# EAGLE design OCTA-STM (EAGLE 8.1.0)

## Sheet 1 of 2
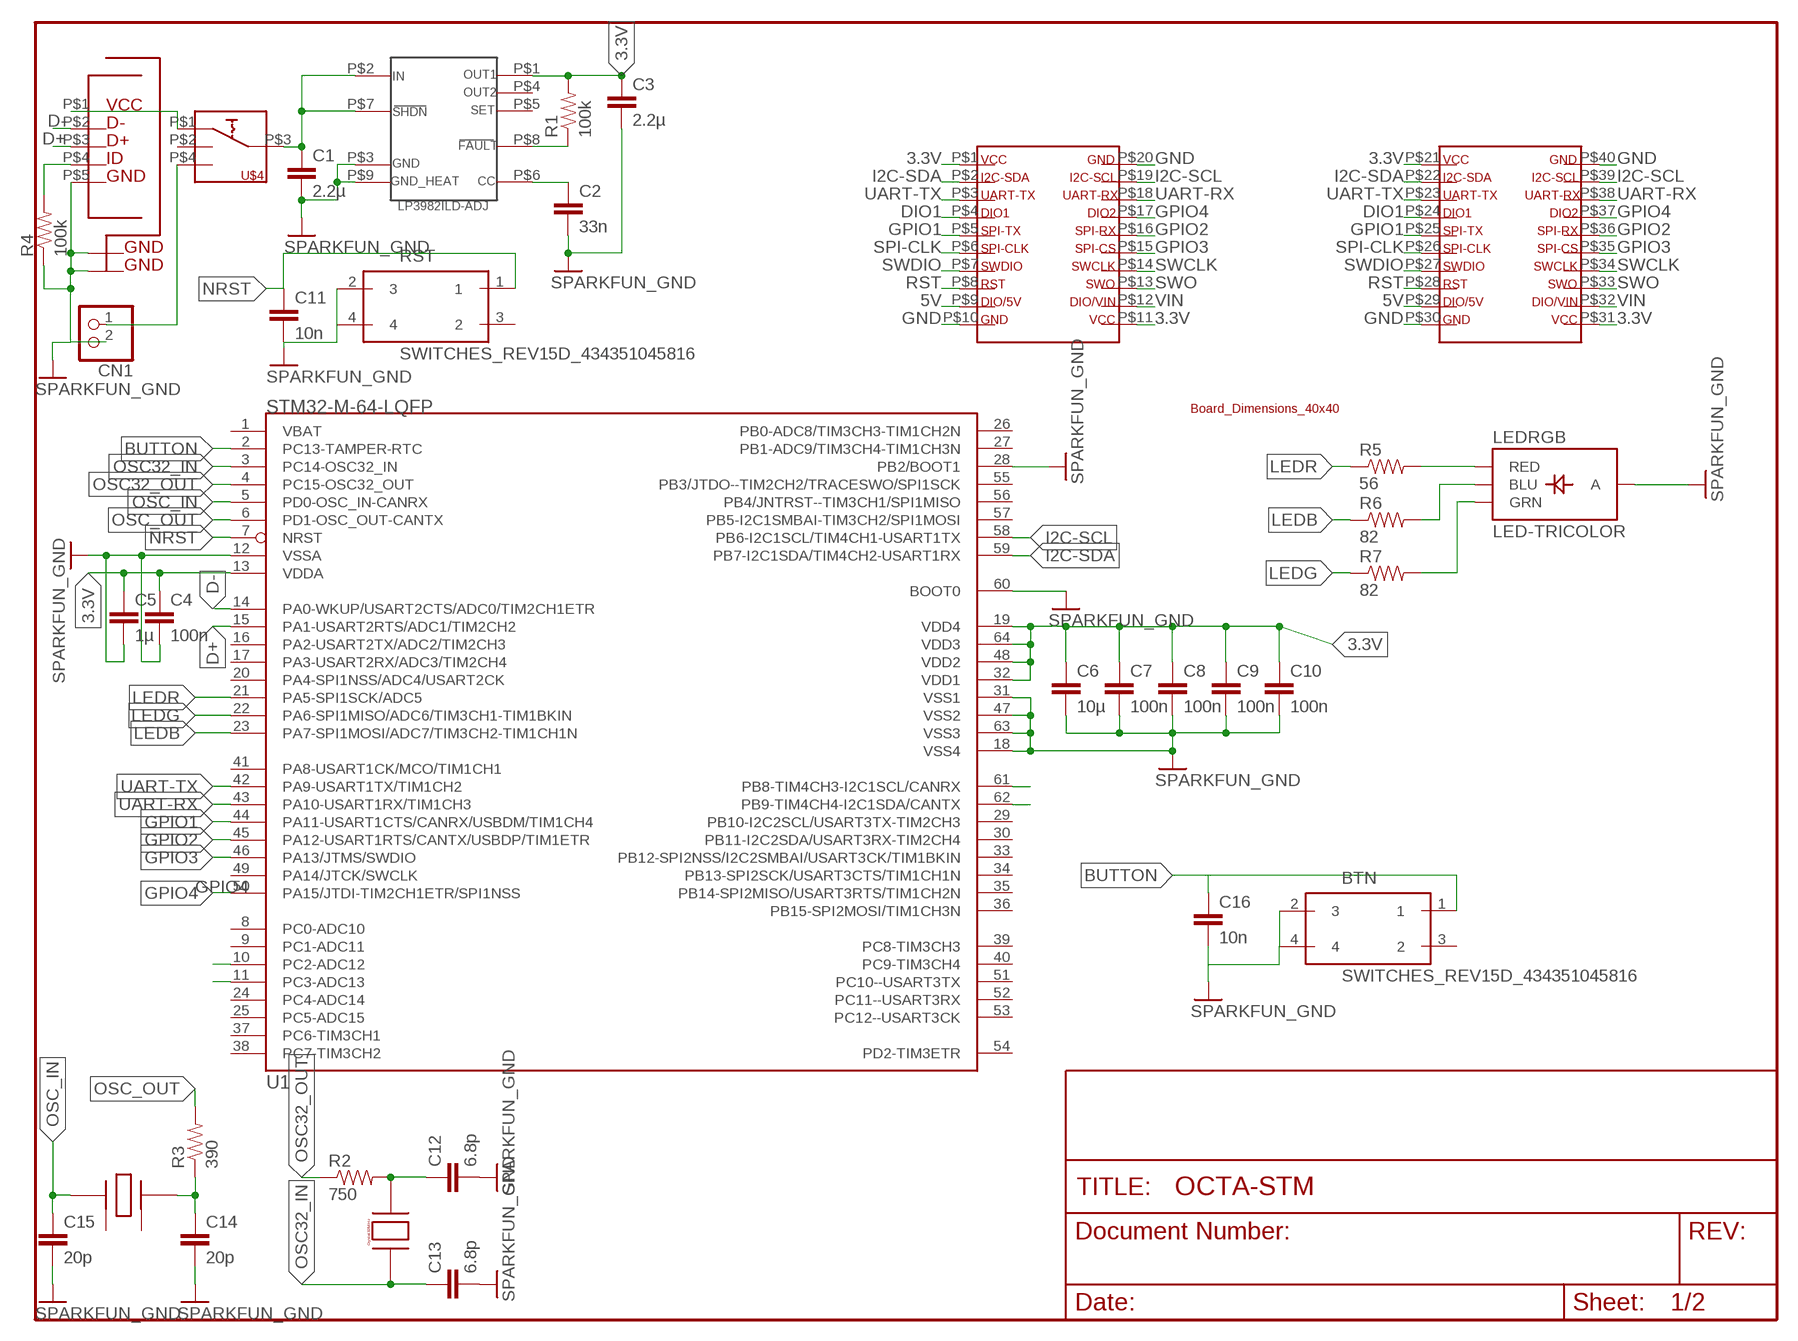
[diagram p0: schematic, sheet 1]

### Parts
BTN  SWITCHES_REV15D_434351045816  [SWITCHES_REV15D_434351045816]
C1  2.2µ  SPARKFUN_CAP0603-CAP  [SPARKFUN_0603-CAP]
C2  33n  SPARKFUN_CAP0603-CAP  [SPARKFUN_0603-CAP]
C3  2.2µ  SPARKFUN_CAP0603-CAP  [SPARKFUN_0603-CAP]
C4  100n  SPARKFUN_CAP0603-CAP  [SPARKFUN_0603-CAP]
C5  1µ  SPARKFUN_CAP0603-CAP  [SPARKFUN_0603-CAP]
C6  10µ  SPARKFUN_CAP0603-CAP  [SPARKFUN_0603-CAP]
C7  100n  SPARKFUN_CAP0603-CAP  [SPARKFUN_0603-CAP]
C8  100n  SPARKFUN_CAP0603-CAP  [SPARKFUN_0603-CAP]
C9  100n  SPARKFUN_CAP0603-CAP  [SPARKFUN_0603-CAP]
C10  100n  SPARKFUN_CAP0603-CAP  [SPARKFUN_0603-CAP]
C11  10n  SPARKFUN_CAP0603-CAP  [SPARKFUN_0603-CAP]
C12  6.8p  SPARKFUN_CAP0603-CAP  [SPARKFUN_0603-CAP]
C13  6.8p  SPARKFUN_CAP0603-CAP  [SPARKFUN_0603-CAP]
C14  20p  SPARKFUN_CAP0603-CAP  [SPARKFUN_0603-CAP]
C15  20p  SPARKFUN_CAP0603-CAP  [SPARKFUN_0603-CAP]
C16  10n  SPARKFUN_CAP0603-CAP  [SPARKFUN_0603-CAP]
CN1  ADAFRUIT_JST_2PIN-SMT-RA  [ADAFRUIT_JST-PH-2-SMT-RA]
LEDRGB  LED-TRICOLOR  [LED-TRICOLOR-SMD]
R1  100k  SPARKFUN_RESISTOR0603-RES  [SPARKFUN_0603-RES]
R2  750  SPARKFUN_RESISTOR0603-RES  [SPARKFUN_0603-RES]
R3  390  SPARKFUN_RESISTOR0603-RES  [SPARKFUN_0603-RES]
R4  100k  SPARKFUN_RESISTOR0603-RES  [SPARKFUN_0603-RES]
R5  56  SPARKFUN_RESISTOR0603-RES  [SPARKFUN_0603-RES]
R6  82  SPARKFUN_RESISTOR0603-RES  [SPARKFUN_0603-RES]
R7  82  SPARKFUN_RESISTOR0603-RES  [SPARKFUN_0603-RES]
RST  SWITCHES_REV15D_434351045816  [SWITCHES_REV15D_434351045816]
U1  STM32-M-64-LQFP  [LQFP64]
U$1  OCTA-CORE_MCIRO-USB2  [OCTA-CORE_MICRO-USB2]
U$2  BOARD-DIMENSIONS-40X40  [BOARD-DIMENSIONS-40X40]
U$3  DRAGAN-PERSONAL_TI-3.3V-REGULATOR  [DRAGAN-PERSONAL_TI-3.3V-REGULATOR]
U$4  OCTA-CORE_SP3T  [OCTA-CORE_SP3T]
U$5  DRAGAN-PERSONAL_CRYSTAL_32MHZ  [DRAGAN-PERSONAL_CRYSTAL_32MHZ]
U$7  DRAGAN-PERSONAL_XTAL-26MHZ  [DRAGAN-PERSONAL_XTAL-26MHZ]

### Nets
3.3V: C3.1 C4.1 C5.1 C6.1 C7.1 C8.1 C9.1 C10.1 R1.2 U1.13(VDDA) U1.19(VDD4) U1.32(VDD1) U1.48(VDD2) U1.64(VDD3) U$2.P$1 U$2.P$11 U$2.P$21 U$2.P$31 U$3.P$1
5V: U$2.P$9 U$2.P$29
10: U1.10(PC2-ADC12)
11: U1.11(PC3-ADC13)
61: U1.61(PB8-TIM4CH3-I2C1SCL/CANRX)
62: U1.62(PB9-TIM4CH4-I2C1SDA/CANTX)
BUTTON: BTN.1 C16.1 U1.2(PC13-TAMPER-RTC)
D+: U1.15(PA1-USART2RTS/ADC1/TIM2CH2) U$1.P$3
D-: U1.14(PA0-WKUP/USART2CTS/ADC0/TIM2CH1ETR) U$1.P$2
DIO1: U$2.P$4 U$2.P$24
GND: BTN.2 BTN.4 C1.2 C2.2 C3.2 C4.2 C5.2 C6.2 C7.2 C8.2 C9.2 C10.2 C11.2 C12.2 C13.2 C14.2 C15.2 C16.2 CN1.2 LEDRGB.A R4.1 RST.2 RST.4 U1.12(VSSA) U1.18(VSS4) U1.28(PB2/BOOT1) U1.31(VSS1) U1.47(VSS2) U1.60(BOOT0) U1.63(VSS3) U$1.P$5 U$1.P$6 U$1.P$7 U$1.P$8 U$1.P$9 U$1.P$10 U$1.P$11 U$1.P$12 U$1.P$13 U$2.P$10 U$2.P$20 U$2.P$30 U$2.P$40 U$3.P$3 U$3.P$9 ; supply symbol labelled SPARKFUN_GND ; also sheet 2
GPIO1: U1.44(PA11-USART1CTS/CANRX/USBDM/TIM1CH4) U$2.P$5 U$2.P$25
GPIO2: U1.45(PA12-USART1RTS/CANTX/USBDP/TIM1ETR) U$2.P$16 U$2.P$36
GPIO3: U1.46(PA13/JTMS/SWDIO) U$2.P$15 U$2.P$35
GPIO4: U1.50(PA15/JTDI-TIM2CH1ETR/SPI1NSS) U$2.P$17 U$2.P$37
I2C-SCL: U1.58(PB6-I2C1SCL/TIM4CH1-USART1TX) U$2.P$19 U$2.P$39
I2C-SDA: U1.59(PB7-I2C1SDA/TIM4CH2-USART1RX) U$2.P$2 U$2.P$22
LEDB: R6.1 U1.23(PA7-SPI1MOSI/ADC7/TIM3CH2-TIM1CH1N)
LEDG: R7.1 U1.22(PA6-SPI1MISO/ADC6/TIM3CH1-TIM1BKIN)
LEDR: R5.1 U1.21(PA5-SPI1SCK/ADC5)
N$1: LEDRGB.R(RED) R5.2
N$2: LEDRGB.B(BLU) R6.2
N$4: C1.1 U$3.P$2 U$3.P$7 U$4.P$3
N$5: C2.1 U$3.P$6
N$6: C12.1 R2.2 U$5.P$2
N$7: R1.1 U$3.P$8
N$8: R4.2 U$1.P$4
N$9: C14.1 R3.1 U$7.P$3
N$10: LEDRGB.G(GRN) R7.2
NRST: C11.1 RST.1 U1.7(NRST)
OSC32_IN: C13.1 U1.3(PC14-OSC32_IN) U$5.P$3
OSC32_OUT: R2.1 U1.4(PC15-OSC32_OUT)
OSC_IN: C15.1 U1.5(PD0-OSC_IN-CANRX) U$7.P$1
OSC_OUT: R3.2 U1.6(PD1-OSC_OUT-CANTX)
RST: U$2.P$8 U$2.P$28
SPI-CLK: U$2.P$6 U$2.P$26
SWCLK: U$2.P$14 U$2.P$34
SWDIO: U$2.P$7 U$2.P$27
SWO: U$2.P$13 U$2.P$33
UART-RX: U1.43(PA10-USART1RX/TIM1CH3) U$2.P$18 U$2.P$38
UART-TX: U1.42(PA9-USART1TX/TIM1CH2) U$2.P$3 U$2.P$23
VIN: U$2.P$12 U$2.P$32
VLIPO: CN1.1 U$4.P$4 ; also sheet 2
VUSB+: U$1.P$1 U$4.P$1 ; also sheet 2
Unconnected: BTN.3 RST.3 U1.1(VBAT) U1.8(PC0-ADC10) U1.9(PC1-ADC11) U1.16(PA2-USART2TX/ADC2/TIM2CH3) U1.17(PA3-USART2RX/ADC3/TIM2CH4) U1.20(PA4-SPI1NSS/ADC4/USART2CK) U1.24(PC4-ADC14) U1.25(PC5-ADC15) U1.26(PB0-ADC8/TIM3CH3-TIM1CH2N) U1.27(PB1-ADC9/TIM3CH4-TIM1CH3N) U1.29(PB10-I2C2SCL/USART3TX-TIM2CH3) U1.30(PB11-I2C2SDA/USART3RX-TIM2CH4) U1.33(PB12-SPI2NSS/I2C2SMBAI/USART3CK/TIM1BKIN) U1.34(PB13-SPI2SCK/USART3CTS/TIM1CH1N) U1.35(PB14-SPI2MISO/USART3RTS/TIM1CH2N) U1.36(PB15-SPI2MOSI/TIM1CH3N) U1.37(PC6-TIM3CH1) U1.38(PC7-TIM3CH2) U1.39(PC8-TIM3CH3) U1.40(PC9-TIM3CH4) U1.41(PA8-USART1CK/MCO/TIM1CH1) U1.49(PA14/JTCK/SWCLK) U1.51(PC10--USART3TX) U1.52(PC11--USART3RX) U1.53(PC12--USART3CK) U1.54(PD2-TIM3ETR) U1.55(PB3/JTDO--TIM2CH2/TRACESWO/SPI1SCK) U1.56(PB4/JNTRST--TIM3CH1/SPI1MISO) U1.57(PB5-I2C1SMBAI-TIM3CH2/SPI1MOSI) U$3.P$4 U$3.P$5 U$4.P$2 U$7.P$2 U$7.P$4

## Sheet 2 of 2
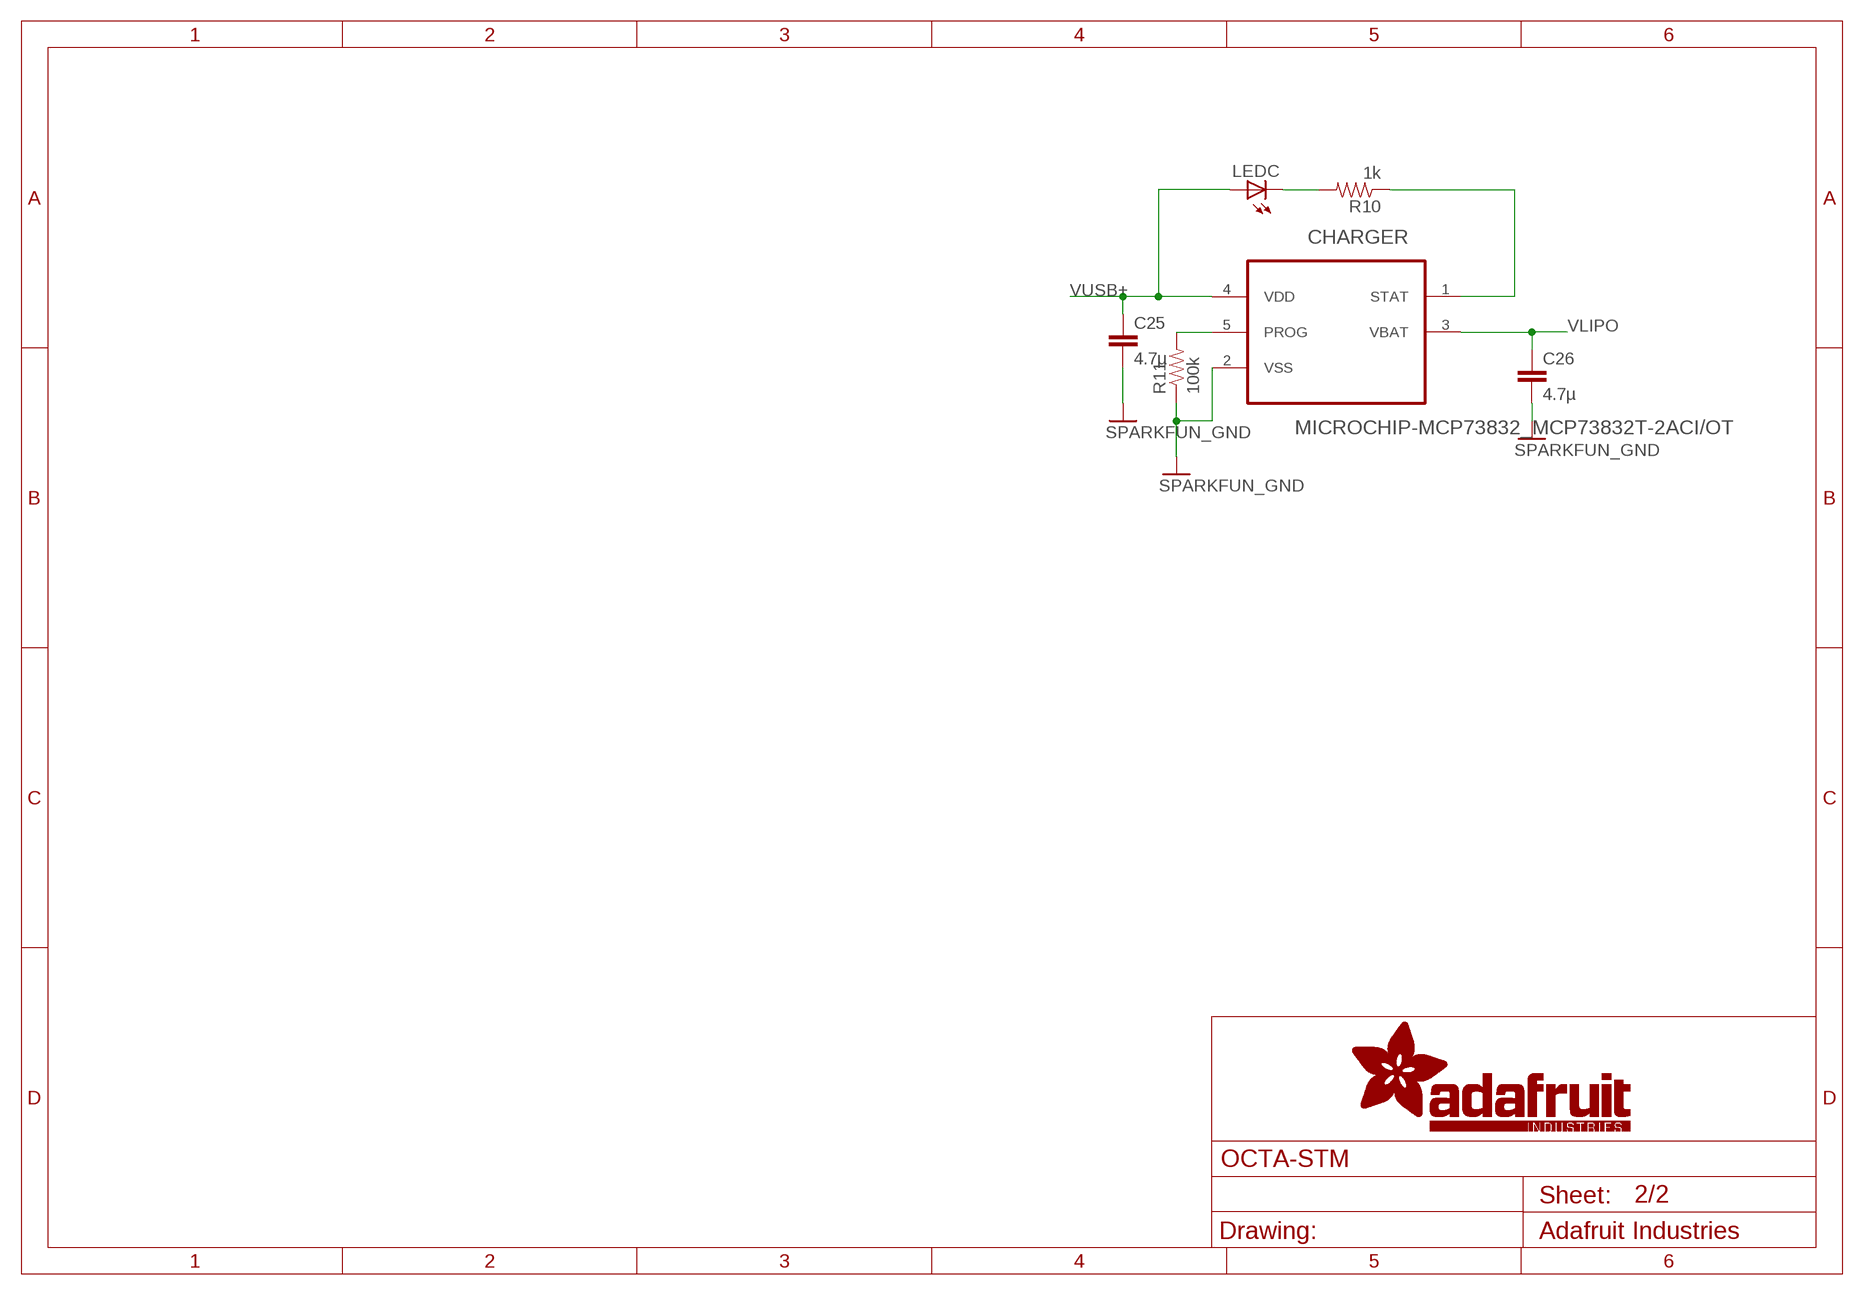
[diagram p1: schematic, sheet 2]

### Parts
C25  4.7µ  SPARKFUN_CAP0603-CAP  [SPARKFUN_0603-CAP]
C26  4.7µ  SPARKFUN_CAP0603-CAP  [SPARKFUN_0603-CAP]
CHARGER  MICROCHIP-MCP73832_MCP73832T-2ACI/OT  [MICROCHIP-MCP73832_SOT95P280X145-5N]
LEDC  LED_LEDCHIP-LED0805  [LED_CHIP-LED0805]
R10  1k  SPARKFUN_RESISTOR0603-RES  [SPARKFUN_0603-RES]
R11  100k  SPARKFUN_RESISTOR0603-RES  [SPARKFUN_0603-RES]

### Nets
GND: C25.2 C26.2 CHARGER.2(VSS) R11.1 ; supply symbol labelled SPARKFUN_GND ; also sheet 1
N$3: CHARGER.5(PROG) R11.2
N$16: LEDC.C R10.2
N$17: CHARGER.1(STAT) R10.1
VLIPO: C26.1 CHARGER.3(VBAT) ; also sheet 1
VUSB+: C25.1 CHARGER.4(VDD) LEDC.A ; also sheet 1

## Library data of the parts
BTN RST = OCTA-EZR_v1:SWITCHES_REV15D_434351045816: WS-TUS-3.5x4.7 mm side push SMD Tact Switch, 4 pins
C1-C16 C25 C26 = OCTA-EZR_v1:SPARKFUN_CAP: Capacitor Standard 0603 ceramic capacitor, and 0.1" leaded capacitor.
CHARGER = OCTA-EZR_v1:MICROCHIP-MCP73832_MCP73832T-2ACI/OT: Charge Management Controller; MPN: MCP73832T-2ACI/OT; OC_FARNELL: 1332159; OC_NEWARK: 88K5656; PACKAGE: SOT-5; SUPPLIER: Microchip
CN1 = OCTA-EZR_v1:ADAFRUIT_JST_2PIN: JST 2-Pin Connectors of various flavors SMT-RA (S2B-PH-SM4) 4UConnector #17311 SMT (B2B-PH-SM4) THM-RA (S2B-PH) THM (B2B-PH)
LEDC = OCTA-EZR_v1:LED_LED: LED OSRAM: - CHIPLED LG R971, LG N971, LY N971, LG Q971, LY Q971, LO R971, LY R971 LH N974, LH R974 LS Q976, LO Q976, LY Q976 LO Q996 - Hyper CHIPLED LW Q18S LB Q993, LB Q99A, LB R99A - SideLED LS A670, LO A670, LY A670, LG A670, LP A670 LB A673, LV A673, LT A673, LW A673 LH A674 LY A675 LS A676, LA A676, LO A676, LY A676, LW A676 LS A679, LY A679, LG A679 - Hyper Micro SIDELED® LS Y876, LA Y876, LO Y876, LY Y876 LT Y87S - SmartLED LW L88C, LW L88S LB L89C, LB L89S, LG L890 LS L89K, LO L89K, LY L89K LS L896, LA L896, LO L896, LY L896 - TOPLED LS T670, LO T670, LY T670, LG T670, LP T670 LSG T670, LSP T670, LSY T670, LOP T670, LYG T670 LG T671, LOG T671, LSG T671 LB T673, LV T673, LT T673, LW T673 LH T674 LS T676, LA T676, LO T676, LY T676, LB T676, LH T676, LSB T676, LW T676 LB T67C, LV T67C, LT T67C, LS T67K, LO T67K, LY T67K, LW E67C LS E67B, LA E67B, LO E67B, LY E67B, LB E67C, LV E67C, LT E67C LW T67C LS T679, LY T679, LG T679 LS T770, LO T770, LY T770, LG T770, LP T770 LB T773, LV T773, LT T773, LW T773 LH T774 LS E675, LA E675, LY E675, LS T675 LS T776, LA T776, LO T776, LY T776, LB T776 LHGB T686 LT T68C, LB T68C - Hyper Mini TOPLED® LB M676 - Mini TOPLED Santana® LG M470 LS M47K, LO M47K, LY M47K Source: http://www.osram.convergy.de LUXEON: - LUMILED® LXK2-PW12-R00, LXK2-PW12-S00, LXK2-PW14-U00, LXK2-PW14-V00 LXK2-PM12-R00, LXK2-PM12-S00, LXK2-PM14-U00 LXK2-PE12-Q00, LXK2-PE12-R00, LXK2-PE12-S00, LXK2-PE14-T00, LXK2-PE14-U00 LXK2-PB12-K00, LXK2-PB12-L00, LXK2-PB12-M00, LXK2-PB14-N00, LXK2-PB14-P00, LXK2-PB14-Q00 LXK2-PR12-L00, LXK2-PR12-M00, LXK2-PR14-Q00, LXK2-PR14-R00 LXK2-PD12-Q00, LXK2-PD12-R00, LXK2-PD12-S00 LXK2-PH12-R00, LXK2-PH12-S00 LXK2-PL12-P00, LXK2-PL12-Q00, LXK2-PL12-R00 Source: www.luxeon.com KINGBRIGHT: KA-3528ASYC Source: www.kingbright.com
LEDRGB = SparkFun-LED:LED-TRICOLOR: Tri-Color LED SMD Proven layout and schematic for triple color LED in SMD package - common anode. Spark Fun Electronics SKU : COM-07844
R1-R7 R10 R11 = OCTA-EZR_v1:SPARKFUN_RESISTOR: Resistor Basic schematic elements and footprints for 0603, 1206, and PTH resistors.
U1 = pel_stm32:STM32-M-64-LQFP: STM32F103 Medium Density 64pin LQFP
U$1 = OCTA-EZR_v1:OCTA-CORE_MCIRO-USB2: Micr MICRO USB TYPE B RCPT W/ REAR PEGS. Mouser: 649-10118194-0001LF
U$2 = OCTA-CORE:BOARD-DIMENSIONS-40X40
U$3 = OCTA-EZR_v1:DRAGAN-PERSONAL_TI-3.3V-REGULATOR
U$4 = OCTA-EZR_v1:OCTA-CORE_SP3T
U$5 = OCTA-EZR_v1:DRAGAN-PERSONAL_CRYSTAL_32MHZ
U$7 = OCTA-EZR_v1:DRAGAN-PERSONAL_XTAL-26MHZ

## Board
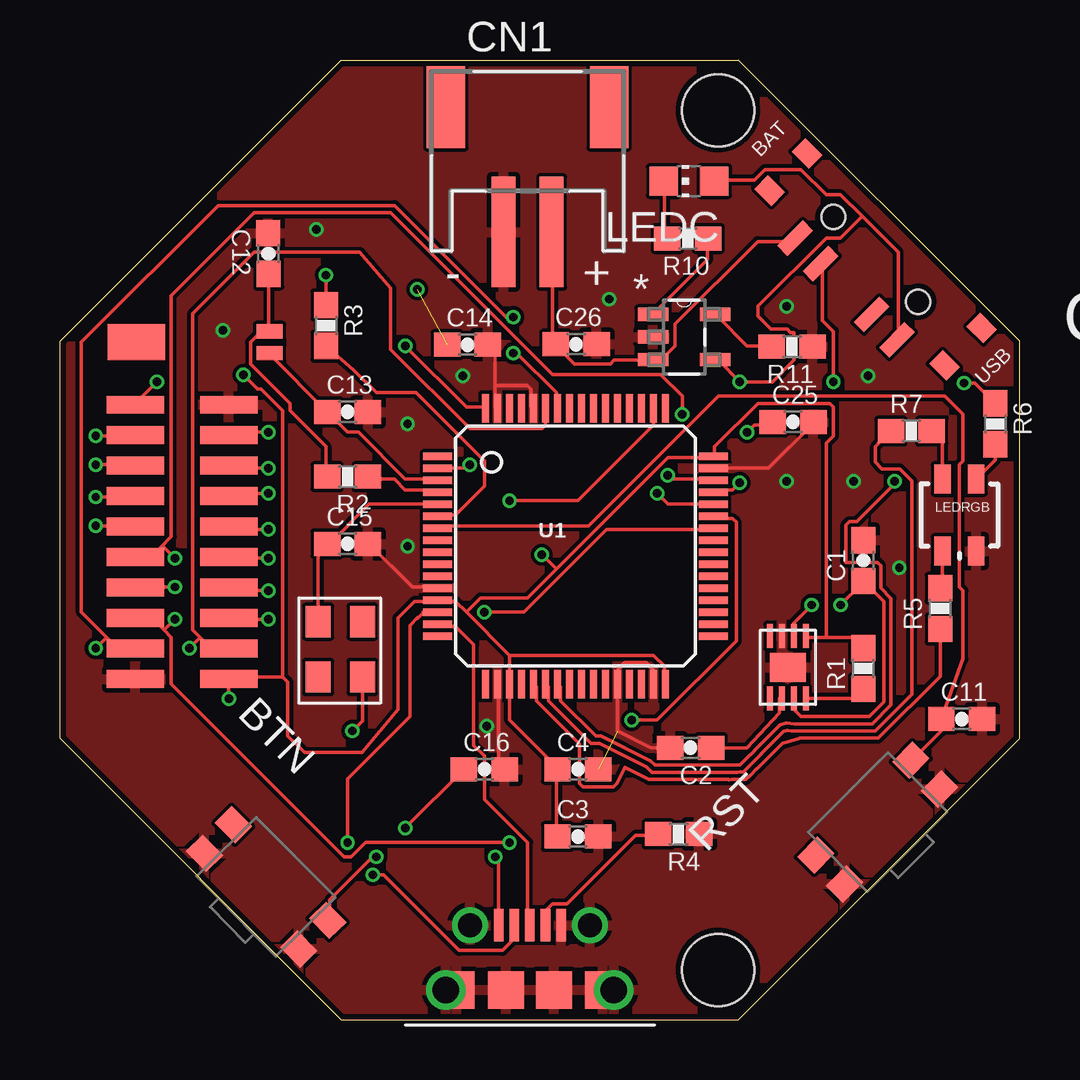
[diagram p2: board, top side]
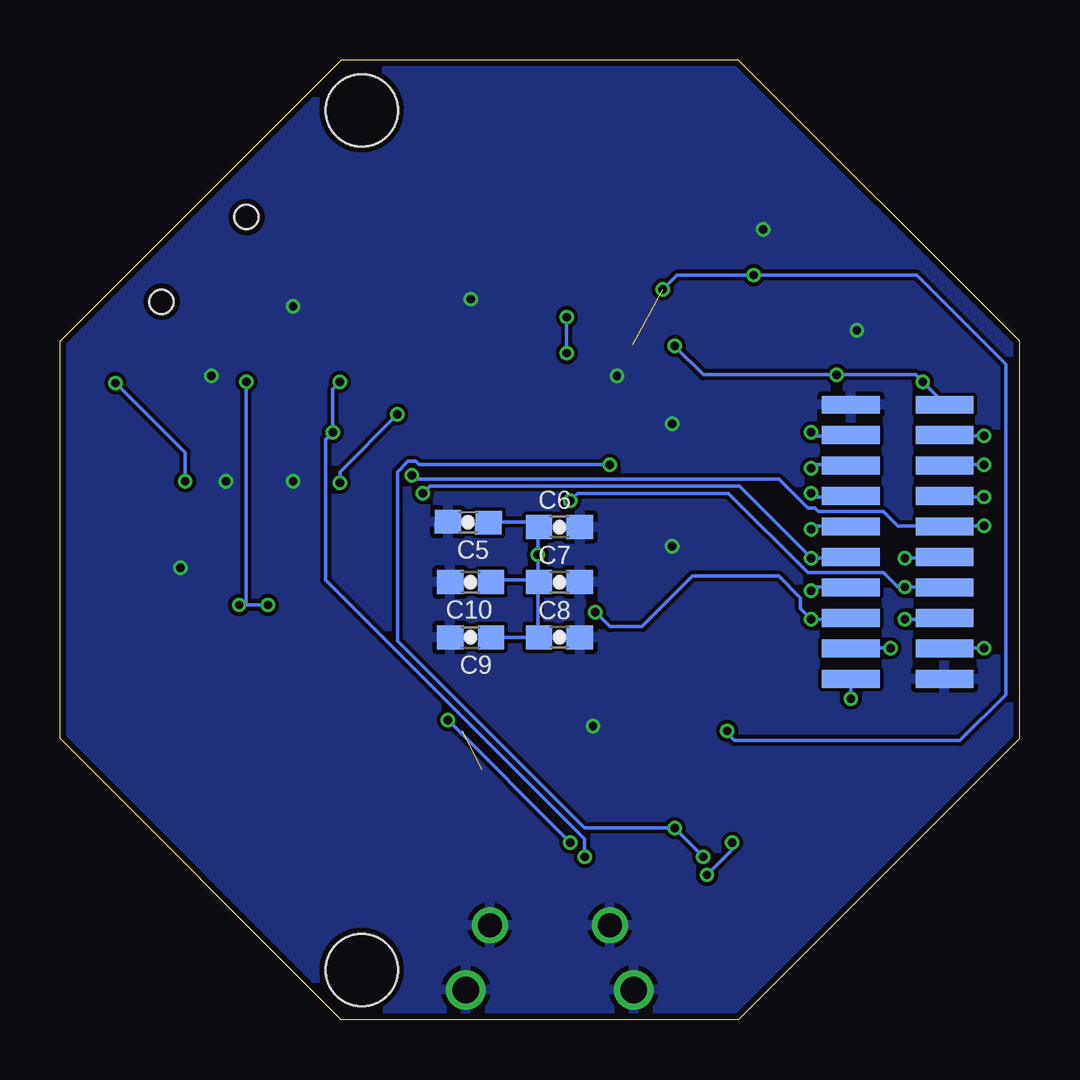
[diagram p3: board, bottom side, seen from below]

Size 40.01 x 40 mm. Coordinates in mm from the lower left corner, seen from the top.
Copper layers (1*16): Top 0.018mm / dielectric 1.55mm / Bottom 0.018mm
Design rules "eC_2Layer_PClass6_BaseCopperO18_eCDefault": minimum track width 0.15mm, minimum drill 0.35mm, track to track 0.15mm, track to pad 0.15mm, pad to pad 0.15mm, via to via 0.15mm, smd to smd 0mil, copper to edge 0.25mm, drill to drill 0.35mm, minimum pad ring 0.175mm, minimum via ring 0.125mm, stop-mask expansion 0mil, vias tented up to drill 0.45mm, thermal gap 0.2mm

### Footprints (pad centres in the part's own frame; a part is rotated, then mirrored left to right if it is on the bottom)
SWITCHES_REV15D_434351045816 = smd 1.2 x 1: 1 2.8,0.85; 2 2.8,-0.85; 3 -2.8,0.85; 4 -2.8,-0.85
SPARKFUN_0603-CAP = smd 1.1 x 1: 1 -0.85,0; 2 0.85,0
MICROCHIP-MCP73832_SOT95P280X145-5N = smd 1.27 x 0.559: 1 -1.295,0.94; 2 -1.295,0; 3 -1.295,-0.94; 4 1.295,-0.94; 5 1.295,0.94
ADAFRUIT_JST-PH-2-SMT-RA = smd 1 x 4.6: 1 1,-3.7; 2 -1,-3.7 | smd 1.6 x 3.4: NC1 -3.4,1.5; NC2 3.4,1.5
LED_CHIP-LED0805 = smd 1.2 x 1.2: A 0,-1.05; C 0,1.05
LED-TRICOLOR-SMD = smd 0.7 x 1.2: A 0.7,-1.5; B 0.7,1.5; G -0.7,1.5; R -0.7,-1.5
SPARKFUN_0603-RES = smd 1.1 x 1: 1 -0.85,0; 2 0.85,0
LQFP64 = smd 1.2 x 0.3: 1 -5.75,3.75; 2 -5.75,3.25; 3 -5.75,2.75; 4 -5.75,2.25; 5 -5.75,1.75; 6 -5.75,1.25; 7 -5.75,0.75; 8 -5.75,0.25; 9 -5.75,-0.25; 10 -5.75,-0.75; 11 -5.75,-1.25; 12 -5.75,-1.75; 13 -5.75,-2.25; 14 -5.75,-2.75; 15 -5.75,-3.25; 16 -5.75,-3.75; 33 5.75,-3.75; 34 5.75,-3.25; 35 5.75,-2.75; 36 5.75,-2.25; 37 5.75,-1.75; 38 5.75,-1.25; 39 5.75,-0.75; 40 5.75,-0.25; 41 5.75,0.25; 42 5.75,0.75; 43 5.75,1.25; 44 5.75,1.75; 45 5.75,2.25; 46 5.75,2.75; 47 5.75,3.25; 48 5.75,3.75 | smd 0.3 x 1.2: 17 -3.75,-5.75; 18 -3.25,-5.75; 19 -2.75,-5.75; 20 -2.25,-5.75; 21 -1.75,-5.75; 22 -1.25,-5.75; 23 -0.75,-5.75; 24 -0.25,-5.75; 25 0.25,-5.75; 26 0.75,-5.75; 27 1.25,-5.75; 28 1.75,-5.75; 29 2.25,-5.75; 30 2.75,-5.75; 31 3.25,-5.75; 32 3.75,-5.75; 49 3.75,5.75; 50 3.25,5.75; 51 2.75,5.75; 52 2.25,5.75; 53 1.75,5.75; 54 1.25,5.75; 55 0.75,5.75; 56 0.25,5.75; 57 -0.25,5.75; 58 -0.75,5.75; 59 -1.25,5.75; 60 -1.75,5.75; 61 -2.25,5.75; 62 -2.75,5.75; 63 -3.25,5.75; 64 -3.75,5.75
OCTA-CORE_MICRO-USB2 = smd 0.4 x 1.35: P$1 -1.3,0; P$2 -0.65,0; P$3 0,0; P$4 0.65,0; P$5 1.3,0 | drill 1 pad 1.5: P$6 -2.5,0; P$7 2.5,0 | smd 1.5 x 1.55: P$8 1,-2.7; P$9 -1,-2.7; P$10 -3.05,-2.7; P$11 3.05,-2.7 | drill 1.1 pad 1.6: P$12 -3.5,-2.7; P$13 3.5,-2.7
BOARD-DIMENSIONS-40X40 = smd 2.4 x 0.74: P$1 7.05,2.47; P$2 7.05,3.74; P$3 7.05,5.01; P$4 7.05,6.28; P$5 7.05,7.55; P$6 7.05,8.82; P$7 7.05,10.09; P$8 7.05,11.36; P$9 7.05,12.63; P$10 7.05,13.9; P$11 3.15,13.9; P$12 3.15,12.63; P$13 3.15,11.36; P$14 3.15,10.09; P$15 3.15,8.82; P$16 3.15,7.55; P$17 3.15,6.28; P$18 3.15,5.01; P$19 3.15,3.74; P$20 3.15,2.47 | smd 2.4 x 0.74 bottom: P$21 7.05,2.47; P$22 7.05,3.74; P$23 7.05,5.01; P$24 7.05,6.28; P$25 7.05,7.55; P$26 7.05,8.82; P$27 7.05,10.09; P$28 7.05,11.36; P$29 7.05,12.63; P$30 7.05,13.9; P$31 3.15,13.9; P$32 3.15,12.63; P$33 3.15,11.36; P$34 3.15,10.09; P$35 3.15,8.82; P$36 3.15,7.55; P$37 3.15,6.28; P$38 3.15,5.01; P$39 3.15,3.74; P$40 3.15,2.47 | hole 3: 27.44,26.17; 27.44,-9.66
DRAGAN-PERSONAL_TI-3.3V-REGULATOR = smd 0.25 x 1: P$1 0,-0.15; P$2 0.5,-0.15; P$3 1,-0.15; P$4 1.5,-0.15; P$5 1.5,2.45; P$6 1,2.45; P$7 0.5,2.45; P$8 0,2.45 | smd 1.5 x 1.2: P$9 0.75,1.15
OCTA-CORE_SP3T = smd 0.6 x 1.5: P$1 0,0; P$2 1.5,0; P$3 4.5,0; P$4 6,0 | smd 1 x 0.8: P$5 -2.15,-0.65; P$6 -2.15,-2.85; P$7 8.15,-0.65; P$8 8.15,-2.85 | hole 1: 0.5,-1.75; 5.5,-1.75
DRAGAN-PERSONAL_CRYSTAL_32MHZ = smd 2.4 x 1.5: P$1 0,0 | smd 1.1 x 0.6: P$2 5.55,0.45; P$3 5.55,-0.45
DRAGAN-PERSONAL_XTAL-26MHZ = smd 1.3 x 1.05: P$1 0,0; P$2 2.3,0; P$3 2.3,1.85; P$4 0,1.85

### Placement (x,y rotation side)
BTN  8.59,5.53 314.6 top
C1  33.49,19.13 90 top
C2  26.29,11.33 180 top
C3  21.59,7.63 0 top
C4  21.59,10.43 0 top
C5  22.99,20.73 179.1 bottom
C6  19.19,20.53 0 bottom
C7  19.19,18.23 0 bottom
C8  19.19,15.93 0 bottom
C9  22.89,15.93 180 bottom
C10  22.89,18.23 180 bottom
C11  37.59,12.53 0 top
C12  8.69,31.93 90.5 top
C13  11.99,25.33 0 top
C14  16.99,28.13 0 top
C15  11.99,19.83 0 top
C16  17.69,10.43 0 top
C25  30.56,24.91 0 top
C26  21.52,28.15 0 top
CHARGER  26.02,28.45 0 top
CN1  19.49,36.53 0 top
LEDC  26.22,34.95 90 top
LEDRGB  37.49,21.03 0 top
R1  33.49,14.63 90 top
R2  11.99,22.63 180 top
R3  11.09,28.93 270 top
R4  25.79,7.73 180 top
R5  36.69,17.13 90 top
R6  38.99,24.83 270 top
R7  35.49,24.53 0 top
R10  26.17,32.56 180 top
R11  30.52,28.05 180 top
RST  34.09,8.23 45 top
U1  21.49,19.73 0 top
U$1  19.59,3.93 0 top
U$2  -0.01,11.73 0 top
U$3  31.09,15.83 180 top
U$4  34.89,28.33 135 top
U$5  3.19,28.23 0 top
U$7  10.76,16.58 270 top

### Tracks (layer width: path | path; a pad name or v marks a point on that pad's centre or on a via)
3.3V  (via drill 0.35)
  Top 0.15: v14.39,28.08 16.94,25.53 17.69,25.53 U1.64 | v4.04,26.58 3.14,25.68 U$2.P$31 | v7.04,13.38 U$2.P$1 7.04,14.28 9.29,14.28 | 31.94,15.93 32.99,15.93 33.44,15.48 R1.2 | 31.94,15.93 31.19,15.93 U$3.P$1 | C3.1 20.69,7.68 20.69,10.38 C4.1 20.69,10.53 18.74,12.48 U1.19 18.74,15.18 | 15.74,17.43 16.49,17.43 16.94,16.98 | 18.74,15.18 16.94,16.98 | 18.74,15.18 24.74,15.18 25.19,14.73 25.19,13.98 U1.32 | 20.69,18.78 19.49,17.58 17.54,17.58 16.94,16.98 | 20.69,18.78 25.34,23.43 27.14,23.43 U1.48 27.29,23.58 27.29,23.88 29.09,25.68 32.09,25.68 32.24,25.53 32.24,24.33 31.94,24.03 31.94,15.93 | 15.74,17.43 U1.13 | 20.69,18.78 v20.09,19.38 | v7.64,26.88 8.24,26.28 8.39,26.28 9.29,25.38 9.29,14.28 | 9.29,14.28 9.49,14.08 9.49,11.83 10.19,11.13 12.59,11.13 14.09,12.93 14.09,16.73 14.79,17.43 15.74,17.43
  Bottom 0.15: v14.39,28.08 13.19,26.88 v7.64,26.88 4.34,26.88 v4.04,26.58 3.14,25.68 U$2.P$31 | C9.1 20.09,15.93 | 20.09,18.33 v20.09,19.38 20.09,20.43 C6.1 20.24,20.73 22.04,20.73 C5.1 | 20.09,18.33 22.04,18.33 C10.1 | 20.09,18.33 C7.1 20.09,18.18 20.09,15.93 | 20.09,15.93 C8.1 | v7.04,13.38 U$2.P$1
5V  (via drill 0.35)
  Top 0.15: v8.69,24.48 7.04,24.48 U$2.P$29
  Bottom 0.15: v8.69,24.48 8.54,24.33 7.04,24.33 U$2.P$29
BUTTON  (via drill 0.35)
  Top 0.15: v14.39,7.98 C16.1 | v13.19,6.78 13.04,6.78 11.24,4.98 11.24,4.23 BTN.1 | U1.2 16.94,22.98 v17.09,23.13
  Bottom 0.15: v13.19,6.78 v14.39,7.98 18.14,7.98 25.94,15.78 25.94,22.83 25.49,23.28 25.19,23.28 25.04,23.13 v17.09,23.13
D+
  Top 0.15: U1.15 15.74,16.38 16.49,16.38 17.24,15.63 17.24,11.43 17.69,10.98 17.69,9.18 19.49,7.38 19.49,3.93 U$1.P$3
D-  (via drill 0.35)
  Top 0.15: U1.14 15.14,16.98 15.14,16.95 14.92,16.72 14.92,16.76 14.59,16.43 14.59,12.63 11.99,10.03 v11.99,7.38 | v13.04,6.03 13.49,6.03 16.64,2.88 18.44,2.88 18.89,3.33 18.89,3.93 U$1.P$2
  Bottom 0.15: v11.99,7.38 11.99,7.08 v13.04,6.03
DIO1  (via drill 0.35)
  Top 0.15: v8.69,17.88 7.04,17.88 U$2.P$24
  Bottom 0.15: v8.69,17.88 8.54,18.03 7.04,18.03 U$2.P$24
GND  (via drill 0.35)  (1 unrouted)
  Top 0.15: U1.31 24.74,14.58 24.44,14.88 23.54,14.88 23.24,14.58 U1.28 23.24,12.03 24.64,11.33 C2.2 | U1.12 15.74,18.03 14.69,18.03 12.89,19.83 C15.2 | C16.2 18.29,10.68 18.29,13.98 U1.18 | 18.14,26.43 18.14,27.78 17.84,28.08 C14.2 | 18.14,26.43 18.14,25.53 U1.63 | 18.14,26.43 19.49,26.43 19.64,26.28 19.64,25.53 U1.60 | U1.47 29.54,22.98 31.34,24.78 C25.2
  other vias: 6.79,28.73 10.69,32.93 30.29,22.43 14.49,19.73 33.09,22.43 33.69,26.83 34.99,18.83 30.29,29.73 22.89,30.03 16.79,26.83 14.49,24.83 17.79,12.23
  pour Top: 0.09,28.33 11.69,39.93 28.39,39.93 40.09,28.23 40.09,11.73 28.29,-0.07 11.69,-0.07 0.09,11.53
  pour Bottom: -0.01,28.43 -0.01,11.63 11.69,-0.07 28.29,-0.07 40.09,11.73 40.09,28.23 28.39,39.93 11.69,39.93 11.39,39.93 11.39,39.83
GPIO1  (via drill 0.35)
  Top 0.15: U1.44 25.34,21.48 v24.89,21.93 | v8.69,19.23 7.04,19.23 U$2.P$25
  Bottom 0.15: v24.89,21.93 24.59,22.23 11.69,22.23 v8.69,19.23 7.04,19.23 U$2.P$25
GPIO2  (via drill 0.35)
  Top 0.15: v28.34,22.38 28.04,22.08 27.29,22.08 U1.45 | v25.94,25.23 25.94,25.98 25.04,26.88 20.54,26.88 13.79,33.63 8.09,33.63 4.64,30.18 4.64,20.13 4.19,19.68 | 4.19,19.68 3.89,19.38 3.14,19.38 U$2.P$36 | v4.79,19.23 4.34,19.68 4.19,19.68
  Bottom 0.15: v28.34,22.38 28.34,22.83 v25.94,25.23 | v4.79,19.23 3.14,19.23 U$2.P$36
GPIO3  (via drill 0.35)
  Top 0.15: v25.34,22.68 25.49,22.53 27.14,22.53 U1.46 | v1.49,20.58 3.14,20.58 U$2.P$35
  Bottom 0.15: v25.34,22.68 25.19,22.53 10.04,22.53 8.84,21.33 8.54,21.33 8.39,21.18 5.69,21.18 5.09,20.58 3.14,20.58 | 3.14,20.58 v1.49,20.58 | 3.14,20.58 U$2.P$35
GPIO4  (via drill 0.35)
  Top 0.15: U1.50 24.74,24.78 21.59,21.63 v18.74,21.63 | v4.79,18.03 3.14,18.03 U$2.P$37
  Bottom 0.15: v18.74,21.63 18.44,21.93 12.14,21.93 8.84,18.63 5.69,18.63 5.09,18.03 v4.79,18.03 3.14,18.03 U$2.P$37
I2C-SCL  (via drill 0.35)
  Top 0.15: v18.89,27.78 19.04,27.78 20.69,26.13 20.69,25.53 U1.58 | v18.89,29.28 18.59,29.28 13.94,33.93 6.59,33.93 0.89,28.23 0.89,16.98 1.94,15.93 | 1.94,15.93 2.39,15.48 U$2.P$39 | 1.94,15.93 v1.49,15.48
  Bottom 0.15: v18.89,29.28 v18.89,27.78 | v1.49,15.48 U$2.P$39
I2C-SDA  (via drill 0.35)
  Top 0.15: U1.59 20.24,24.78 20.09,24.63 17.09,24.63 13.79,27.93 13.79,30.48 12.49,31.98 8.09,31.98 5.54,29.43 5.54,16.23 5.84,15.93 | 5.84,15.93 6.29,15.48 U$2.P$22 | 5.84,15.93 v5.39,15.48
  Bottom 0.15: v5.39,15.48 U$2.P$22
LEDB  (via drill 0.35)
  Top 0.15: U1.23 20.86,13.86 20.86,13.29 22.33,11.82 22.55,11.82 24.62,10.79 24.8,10.61 26.08,10.61 26.39,10.61 26.5,10.61 28.11,10.61 28.35,10.61 28.77,11.03 28.77,11.04 28.86,11.12 28.94,11.21 30.01,12.27 30.29,12.36 30.61,12.33 33.86,12.33 34.64,13.11 34.64,17.55 34.22,17.98 34.22,18.92 34.08,19.05 32.77,19.05 32.77,20.62 32.9,20.76 33.22,20.76 34.79,22.33 v34.79,22.43 | v37.69,26.53 38.14,26.53 R6.1
  Bottom 0.15: v34.79,22.43 34.79,23.63 v37.69,26.53
LEDG
  Top 0.15: R7.1 33.99,23.88 33.99,23.23 34.27,22.95 35.01,22.95 35.52,22.45 35.52,13.56 33.99,12.03 30.72,12.03 30.71,12.02 30.6,12.03 30.49,12.03 30.48,12.04 30.32,12.05 30.16,12.01 29.24,11.09 29.24,11.08 29.07,10.91 28.91,10.74 | 27.99,10.3 28.11,10.3 28.23,10.3 28.23,10.31 28.35,10.31 28.47,10.31 28.48,10.32 28.56,10.41 28.58,10.41 28.91,10.74 | 28.91,10.74 | U1.22 20.36,13.86 20.36,13.29 22.13,11.52 22.48,11.52 24.44,10.54 24.67,10.3 25.96,10.3 26.08,10.3 26.21,10.3 26.37,10.31 26.37,10.3 26.49,10.3 27.99,10.3 | 27.99,10.3
LEDR
  Top 0.15: 24.8,10.01 24.55,10.01 23.55,10.51 23.21,9.84 23.08,9.71 21.8,9.71 21.66,9.84 21.66,11.49 19.86,13.29 19.86,13.86 U1.21 | 24.8,10.01 | 25.84,10 | 25.84,10 25.97,10 26.08,10.01 26.09,10 26.21,10.01 26.36,10.01 26.37,10 26.49,10 26.61,10 27.87,10 27.88,10 | 27.88,10 | 27.88,10 28.01,10 28.48,10 28.6,10.01 28.62,10.02 28.7,10.11 28.71,10.11 28.79,10.2 | 24.8,10.01 24.8,10 25.84,10 | 28.79,10.2 | 28.79,10.2 29.04,10.44 30.11,11.51 30.82,11.71 30.84,11.73 34.11,11.73 36.69,14.31 R5.1
N$1
  Top 0.15: R5.2 36.79,17.98 LEDRGB.R
N$2
  Top 0.15: R6.2 38.99,23.33 LEDRGB.B
N$3
  Top 0.15: R11.2 29.54,28.08 28.64,28.08 27.44,29.28 CHARGER.5
N$4  (via drill 0.35)
  Top 0.15: U$3.P$7 30.59,12.93 30.89,12.63 33.74,12.63 34.34,13.23 34.34,17.43 C1.1 33.44,18.18 v32.54,17.28 | U$3.P$2 30.59,16.53 v31.34,17.28 | v32.24,26.58 32.24,28.68 31.79,29.13 31.79,31.38 U$4.P$3
  Bottom 0.15: v32.54,17.28 32.24,17.28 | 32.24,17.28 v31.34,17.28 | 32.24,17.28 v32.24,26.58
N$5
  Top 0.15: C2.1 28.64,11.33 29.99,12.78 29.99,13.38 U$3.P$6
N$6
  Top 0.15: 8.69,28.98 C12.1 | 8.69,28.98 8.69,28.68 U$5.P$2 | 8.69,28.98 7.94,28.23 7.94,27.33 9.59,25.68 9.59,25.38 11.09,23.88 11.09,22.68 R2.2
N$7
  Top 0.15: U$3.P$8 33.14,13.38 33.44,13.68 R1.1
N$8
  Top 0.15: U$1.P$4 20.24,4.53 20.54,4.83 21.14,4.83 23.99,7.68 24.89,7.68 R4.2
N$9  (via drill 0.35)  (1 unrouted)
  Top 0.15: R3.1 v11.09,31.03 | v12.19,12.03 12.61,12.45 U$7.P$3
  Bottom 0.15: v12.19,12.03 12.29,11.93 12.19,11.93 11.89,11.63 2.49,11.63 0.59,13.53 0.59,27.33 4.29,31.03 v11.09,31.03 14.29,31.03 14.79,30.53 14.89,30.53 v14.89,30.43
N$10
  Top 0.15: R7.2 36.79,24.53 LEDRGB.G
N$16
  Top 0.15: R10.2 25.19,32.58 25.19,34.83 LEDC.C
N$17
  Top 0.15: R10.1 26.99,32.43 26.99,31.68 24.74,29.43 CHARGER.1
NRST
  Top 0.15: RST.1 35.54,10.83 36.74,12.03 C11.1 37.64,15.03 37.64,17.88 37.49,18.03 37.49,23.13 37.64,23.28 37.64,25.23 36.89,25.98 27.44,25.98 22.04,20.58 15.74,20.58 U1.7
OSC32_IN
  Top 0.15: U$5.P$3 8.69,27.78 C13.1 11.99,24.48 12.44,24.48 14.39,22.53 15.74,22.53 U1.3
OSC32_OUT
  Top 0.15: R2.1 12.89,22.53 13.94,22.53 14.39,22.08 15.74,22.08 U1.4
OSC_IN
  Top 0.15: U1.5 12.89,21.48 11.24,19.83 C15.1 | 11.09,19.83 C15.1 | C15.1 10.76,19.45 U$7.P$1
OSC_OUT
  Top 0.15: R3.2 12.24,27.08 13.19,26.13 14.84,26.13 17.69,23.28 17.69,22.23 16.49,21.03 15.74,21.03 U1.6
RST  (via drill 0.35)
  Top 0.15: v8.69,22.98 7.04,22.98 U$2.P$28
  Bottom 0.15: v8.69,22.98 8.54,23.13 7.04,23.13 U$2.P$28
SPI-CLK  (via drill 0.35)
  Top 0.15: v8.69,20.43 7.04,20.43 U$2.P$26
  Bottom 0.15: v8.69,20.43 8.54,20.58 7.04,20.58 U$2.P$26
SWCLK  (via drill 0.35)
  Top 0.15: v1.49,21.78 3.14,21.78 U$2.P$34
  Bottom 0.15: v1.49,21.78 3.14,21.78 U$2.P$34
SWDIO  (via drill 0.35)
  Top 0.15: v8.69,21.93 7.04,21.93 U$2.P$27
  Bottom 0.15: v8.69,21.93 8.54,21.78 7.04,21.78 U$2.P$27
SWO  (via drill 0.35)
  Top 0.15: v1.49,23.13 3.14,23.13 U$2.P$33
  Bottom 0.15: v1.49,23.13 3.14,23.13 U$2.P$33
UART-RX  (via drill 0.35)
  Top 0.15: v23.84,12.48 24.89,12.48 28.19,15.78 28.19,20.73 28.04,20.88 27.29,20.88 U1.43 | v18.74,7.38 12.74,7.38 12.14,6.78 11.84,6.78 4.64,13.98 4.64,15.93 4.34,16.23 | 4.34,16.23 3.89,16.68 3.14,16.68 U$2.P$38 | 4.34,16.23 v4.79,16.68
  Bottom 0.15: v18.74,7.38 v23.84,12.48 | v4.79,16.68 3.14,16.68 U$2.P$38
UART-TX  (via drill 0.35)
  Top 0.15: v17.69,16.98 19.34,16.98 22.79,20.43 27.14,20.43 U1.42 | v8.69,16.68 7.04,16.68 U$2.P$23
  Bottom 0.15: v17.69,16.98 17.09,16.38 15.74,16.38 13.64,18.48 10.04,18.48 9.14,17.58 9.14,17.13 v8.69,16.68 7.04,16.68 U$2.P$23
VIN  (via drill 0.35)
  Top 0.15: v1.49,24.33 3.14,24.33 U$2.P$32
  Bottom 0.15: v1.49,24.33 3.14,24.33 U$2.P$32
VLIPO
  Top 0.15: CN1.1 20.54,32.73 20.54,28.23 C26.1 20.69,28.08 21.44,27.33 22.94,27.33 23.09,27.48 24.59,27.48 CHARGER.3 24.74,27.63 25.19,27.63 25.64,28.08 25.64,28.98 29.09,32.43 30.59,32.43 U$4.P$4
VUSB+  (via drill 0.35)
  Top 0.15: 33.44,33.48 34.94,31.98 34.94,28.38 U$4.P$1 | 33.44,33.48 32.54,34.38 31.94,34.38 30.89,35.43 29.39,35.43 28.94,34.98 27.29,34.98 LEDC.A | v28.64,24.48 28.94,24.78 29.69,24.78 C25.1 | CHARGER.4 27.44,27.48 v28.34,26.58 29.69,26.58 30.59,27.48 30.59,28.63 30.46,28.63 30.31,28.78 29.64,28.78 29.09,29.33 29.09,29.73 31.94,32.58 32.54,32.58 33.44,33.48 | U$1.P$1 18.29,6.63 v18.14,6.78
  Bottom 0.15: v28.34,26.58 28.64,26.28 v28.64,24.48 28.94,24.18 28.94,18.33 18.14,7.53 v18.14,6.78

### Text on the board
tPlace: BAT | USB